# EAGLE design RFM12B-V1.2 (EAGLE 6.6.0)
ABBREV: rf1; PROJECT: RFM12B Board
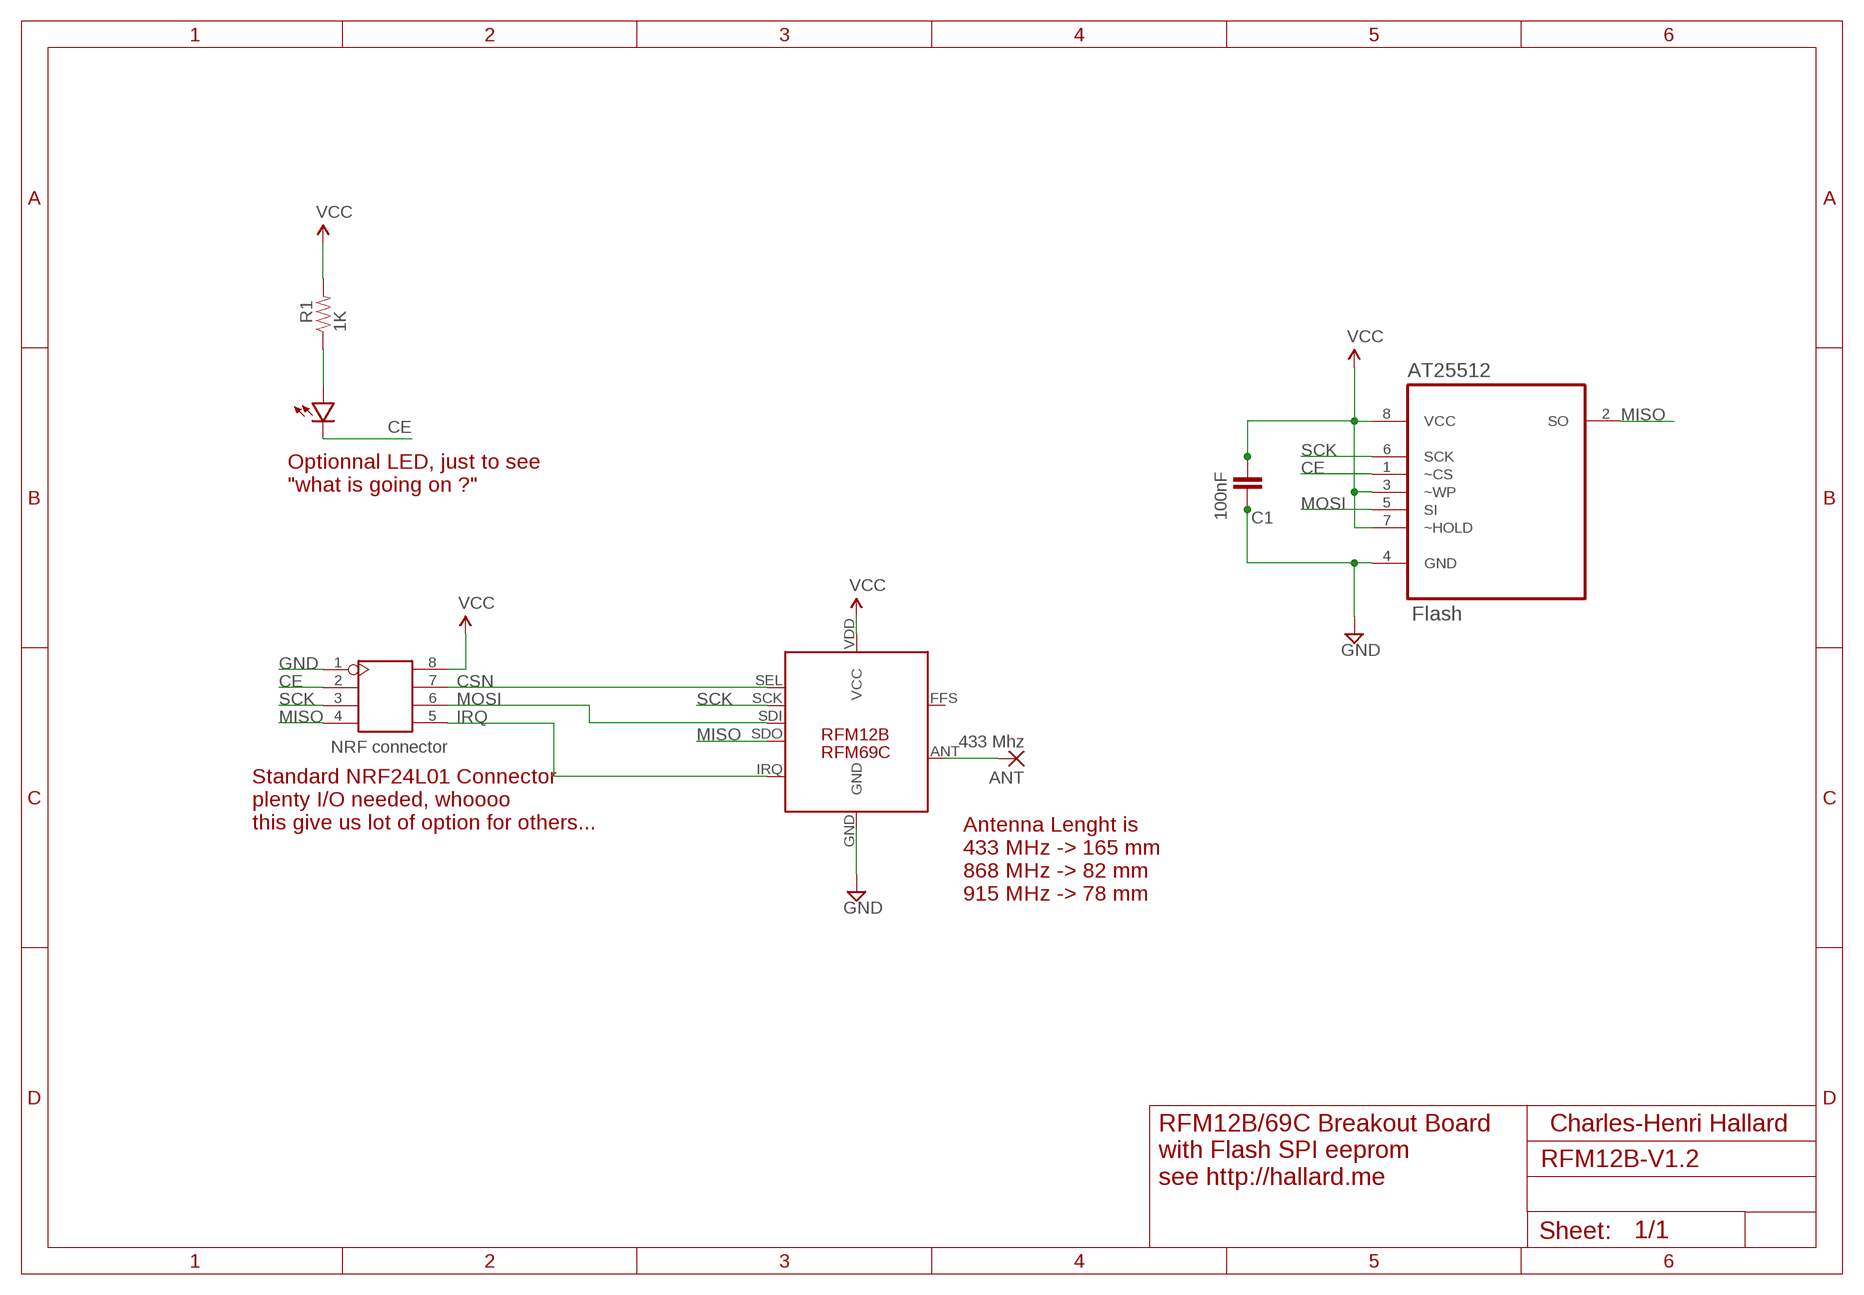
[diagram p0: schematic, sheet 1]

## Parts
ANT  433 Mhz  1,6/0,8  [1,6/0,8]
AT25512  Flash  AT25512N-SH-B  [SOIC127P600X175-8N]
C1  100nF  CAP0805-CAP  [0805-CAP]
J1  NRF connector  HEADER-2X4P-2.54  [2X4P-2.54]
R1  1K  RESISTOR0805-RES  [0805-RES]
U$1  LED0805-LARGE  [0805-LED-LARGEPADS]
U$2  RFM12B  [RFM12B]

## Nets
CE: AT25512.1(~CS) J1.2 U$1.MINUS
CSN: J1.7 U$2.SEL
GND [power]: AT25512.4(GND) C1.2 J1.1 U$2.GND
IRQ: J1.5 U$2.IRQ
MISO: AT25512.2(SO) J1.4 U$2.SDO
MOSI: AT25512.5(SI) J1.6 U$2.SDI
N$1: ANT.1(P) U$2.ANT
N$2: R1.1 U$1.PLUS
SCK: AT25512.6(SCK) J1.3 U$2.SCK
VCC [power]: AT25512.3(~WP) AT25512.7(~HOLD) AT25512.8(VCC) C1.1 J1.8 R1.2 U$2.VDD(VCC)
Unconnected: U$2.FFS

## Notes on the sheet
- Optionnal LED, just to see
  "what is going on ?"
- RFM69C
- Standard NRF24L01 Connector
  plenty I/O needed, whoooo
  this give us lot of option for others...
- Antenna Lenght is
  433 MHz -> 165 mm
  868 MHz -> 82 mm
  915 MHz -> 78 mm
- Charles-Henri Hallard
- RFM12B/69C Breakout Board
  with Flash SPI eeprom
  see http://hallard.me

## Library data of the parts
ANT = JeeLabs:1,6/0,8: THROUGH-HOLE PAD
AT25512 = Atmel_By_element14_Batch_1:AT25512N-SH-B: SPI Serial EEPROM; MPN: AT25512N-SH-B; OC_FARNELL: 1841581; OC_NEWARK: 12T1360; PACKAGE: SOIC-8; SUPPLIER: Atmel
C1 = _c2h:CAP: Capacitor Standard 0603 ceramic capacitor, and 0.1" leaded capacitor.
J1 = Seeed-Connector:HEADER-2X4P
R1 = _c2h:RESISTOR: Resistor Basic schematic elements and footprints for 0603, 1206, and PTH resistors.
U$1 = _c2h:LED
U$2 = lh-library:RFM12B

## Net classes
1 power: width 0.203 mm, drill 0.305 mm, clearance 0.152 mm

## Board
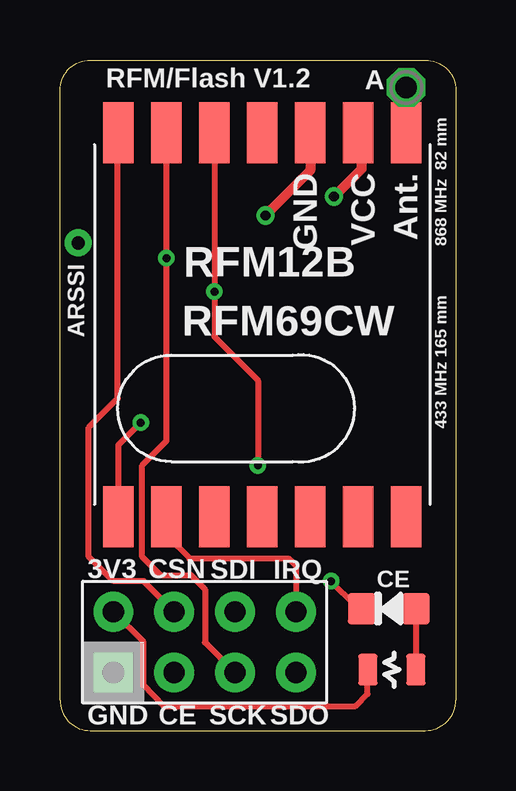
[diagram p1: board, top side]
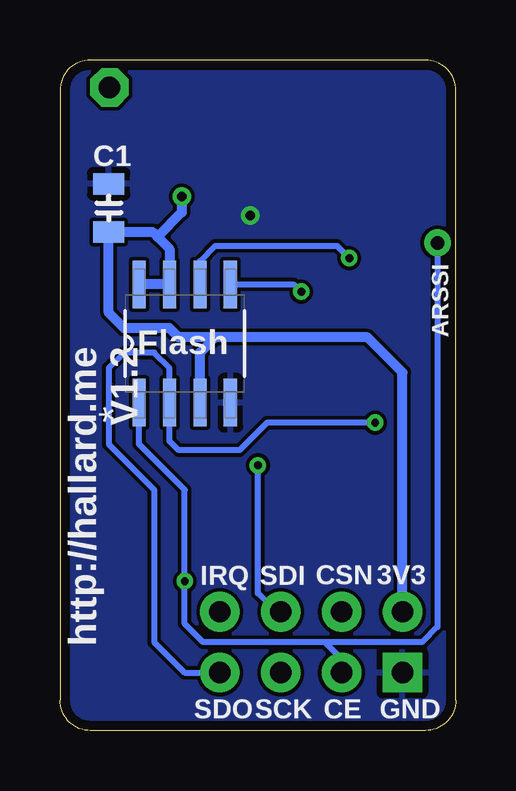
[diagram p2: board, bottom side, seen from below]

Size 16.51 x 27.94 mm. Coordinates in mm from the lower left corner, seen from the top.
Outline: 0,26.67 0,1.27 arc90 1.27,0 15.24,0 arc90 16.51,1.27 16.51,26.67
Outline: 0,26.67 0,26.72
Outline: 16.51,26.72 16.51,26.67
Outline: 0,26.67 arc-90 1.27,27.94 15.24,27.94 arc-90 16.51,26.67
Copper layers (1*16): Top 0.0356mm / dielectric 1.5011mm / Bottom 0.0356mm
Design rules "LaenPCBOrder *": minimum track width 6mil, minimum drill 13mil, track to track 6mil, track to pad 6mil, pad to pad 6mil, via to via 6mil, smd to smd 6mil, copper to edge 15mil, drill to drill 6mil, minimum pad ring 7mil, minimum via ring 7mil, stop-mask expansion 3mil, vias tented up to drill 100mil, thermal gap 10mil

### Footprints (pad centres in the part's own frame; a part is rotated, then mirrored left to right if it is on the bottom)
1,6/0,8 = drill 0.9 pad 1.6 octagon: 1 0,0
SOIC127P600X175-8N = smd 1.981 x 0.559: 1 -2.464,1.905; 2 -2.464,0.635; 3 -2.464,-0.635; 4 -2.464,-1.905; 5 2.464,-1.905; 6 2.464,-0.635; 7 2.464,0.635; 8 2.464,1.905
0805-CAP = smd 0.902 x 1.3: 1 -1,0; 2 1,0
2X4P-2.54 = drill 0.889 pad 1.651 square: 1 -1.27,3.81 | drill 0.889 pad 1.651: 2 -1.27,1.27; 3 -1.27,-1.27; 4 -1.27,-3.81; 5 1.27,-3.81; 6 1.27,-1.27; 7 1.27,1.27; 8 1.27,3.81
0805-RES = smd 0.8 x 1.3: 1 -1,0; 2 1,0
0805-LED-LARGEPADS = smd 1.156 x 1.3: MINUS -1.127,0; PLUS 1.127,0
RFM12B = smd 2.54 x 1.27: ANT 8,-6; FFS -8,2; GND 8,-2; IRQ -8,4; P$8 -8,0; P$9 -8,-2; P$10 -8,-4; P$12 -8,-6; P$16 8,0; SCK 8,4; SDI 8,2; SDO -8,6; SEL 8,6; VDD 8,-4

### Placement (x,y rotation side)
ANT  14.44,26.8 0 top
AT25512  11.3,16.13 90 bottom
C1  14.48,21.78 90 bottom
J1  6.03,3.68 90 top
R1  13.84,2.54 180 top
U$1  13.72,5.08 0 top
U$2  8.45,16.92 90 top

### Tracks (layer width: path | path; a pad name or v marks a point on that pad's centre or on a via)
CE  (via drill 0.33, 0.56 pad 1.12)
  Top 0.254: v11.3,6.22 12.34,5.19 12.34,5.08 U$1.MINUS
  Bottom 0.254: J1.2 4.76,2.98 5.46,3.68 | 5.46,3.68 10.54,3.68 11.3,4.45 v11.3,6.22 11.3,10.03 13.21,11.94 AT25512.1 | v0.76,20.32 0.76,4.32 1.4,3.68 5.46,3.68
CSN
  Top 0.203: 2.41,24.88 U$2.SEL
  Top 0.254: J1.7 3.49,6.22 2.22,6.22 1.21,7.24 1.21,12.64 2.41,13.84 2.41,24.88
GND  (via drill 0.41)
  Top 0.381: U$2.GND 10.45,25.55 10.44,25.55
  Top 0.406: U$2.GND 10.45,23.34 v8.57,21.46
  pour Bottom: -1.08,-1.08 -1.08,28.31 17.84,28.31 17.84,-1.08
IRQ
  Top 0.203: U$2.IRQ 4.45,8.13 | J1.5 9.84,4.89
  Top 0.254: 4.45,8.13 5.4,7.18 9.53,7.18 9.84,6.86 J1.5
MISO  (via drill 0.33)
  Top 0.254: U$2.SDO 2.45,11.91 v3.37,12.83
  Bottom 0.254: J1.4 11.3,2.41 12.57,3.68 12.57,10.03 14.48,11.94 14.48,15.11 13.84,15.75 12.57,15.75 11.94,15.11 AT25512.2 11.94,12.06 11.56,11.68 9.02,11.68 7.87,12.83 v3.37,12.83
MOSI  (via drill 0.33)
  Top 0.254: U$2.SDI v6.45,18.29 6.45,16.41 8.26,14.61 v8.26,11.05
  Bottom 0.254: J1.6 7.3,4.76 8.26,5.71 v8.26,11.05 | AT25512.5 6.78,18.59 v6.45,18.29
N$1
  Top 0.203: U$2.ANT 14.45,25.69 14.44,25.69
  Top 0.254: ANT.1 14.44,25.69
N$2
  Top 0.254: U$1.PLUS R1.1
SCK  (via drill 0.33)
  Top 0.254: U$2.SCK v4.45,19.68 4.45,12.07 3.43,11.05 3.43,7.24 4.19,6.48 5.46,6.48 6.04,5.89 6.04,3.67 J1.3
  Bottom 0.203: AT25512.6 10.67,19.56 | 4.95,20.19
  Bottom 0.254: 10.67,19.56 10.03,20.19 4.95,20.19 | 4.95,20.19 v4.45,19.68
VCC  (via drill 0.41)
  Top 0.254: J1.8 3.48,3.7 3.48,1.88 4.32,1.02 12.32,1.02 12.83,1.52 12.83,2.52 R1.2
  Top 0.381: 12.45,25.74 U$2.VDD
  Top 0.406: U$2.VDD 12.57,24.79 12.57,23.39 v11.43,22.25
  Bottom 0.406: AT25512.8 AT25512.7 11.94,20.07 12.45,20.57 | AT25512.3 10.67,15.75 10.03,16.38 | 10.03,16.38 11.56,16.38 11.94,16.76 13.84,16.76 14.48,17.4 C1.1 | J1.8 2.22,14.92 3.68,16.38 10.03,16.38 | C1.1 14.02,20.78 | C1.1 12.65,20.78 12.45,20.57 | v11.43,22.25 11.43,21.59 12.45,20.57

### Text on the board
tNames: RFM/Flash V1.2 | A | GND | VCC | Ant. | 868 MHz 82 mm | ARSSI | RFM69CW | 433 MHz 165 mm | 3V3 | CSN | SDI | IRQ | CE | GND | CE | SCK | SDO
bNames: ARSSI | http://hallard.me / V1.2 | 3V3 | CSN | SDI | IRQ | GND | CE | SCK | SDO